# Altium schematic sheet 01-COVER PAGE.SchDoc
size 513 x 386 mm
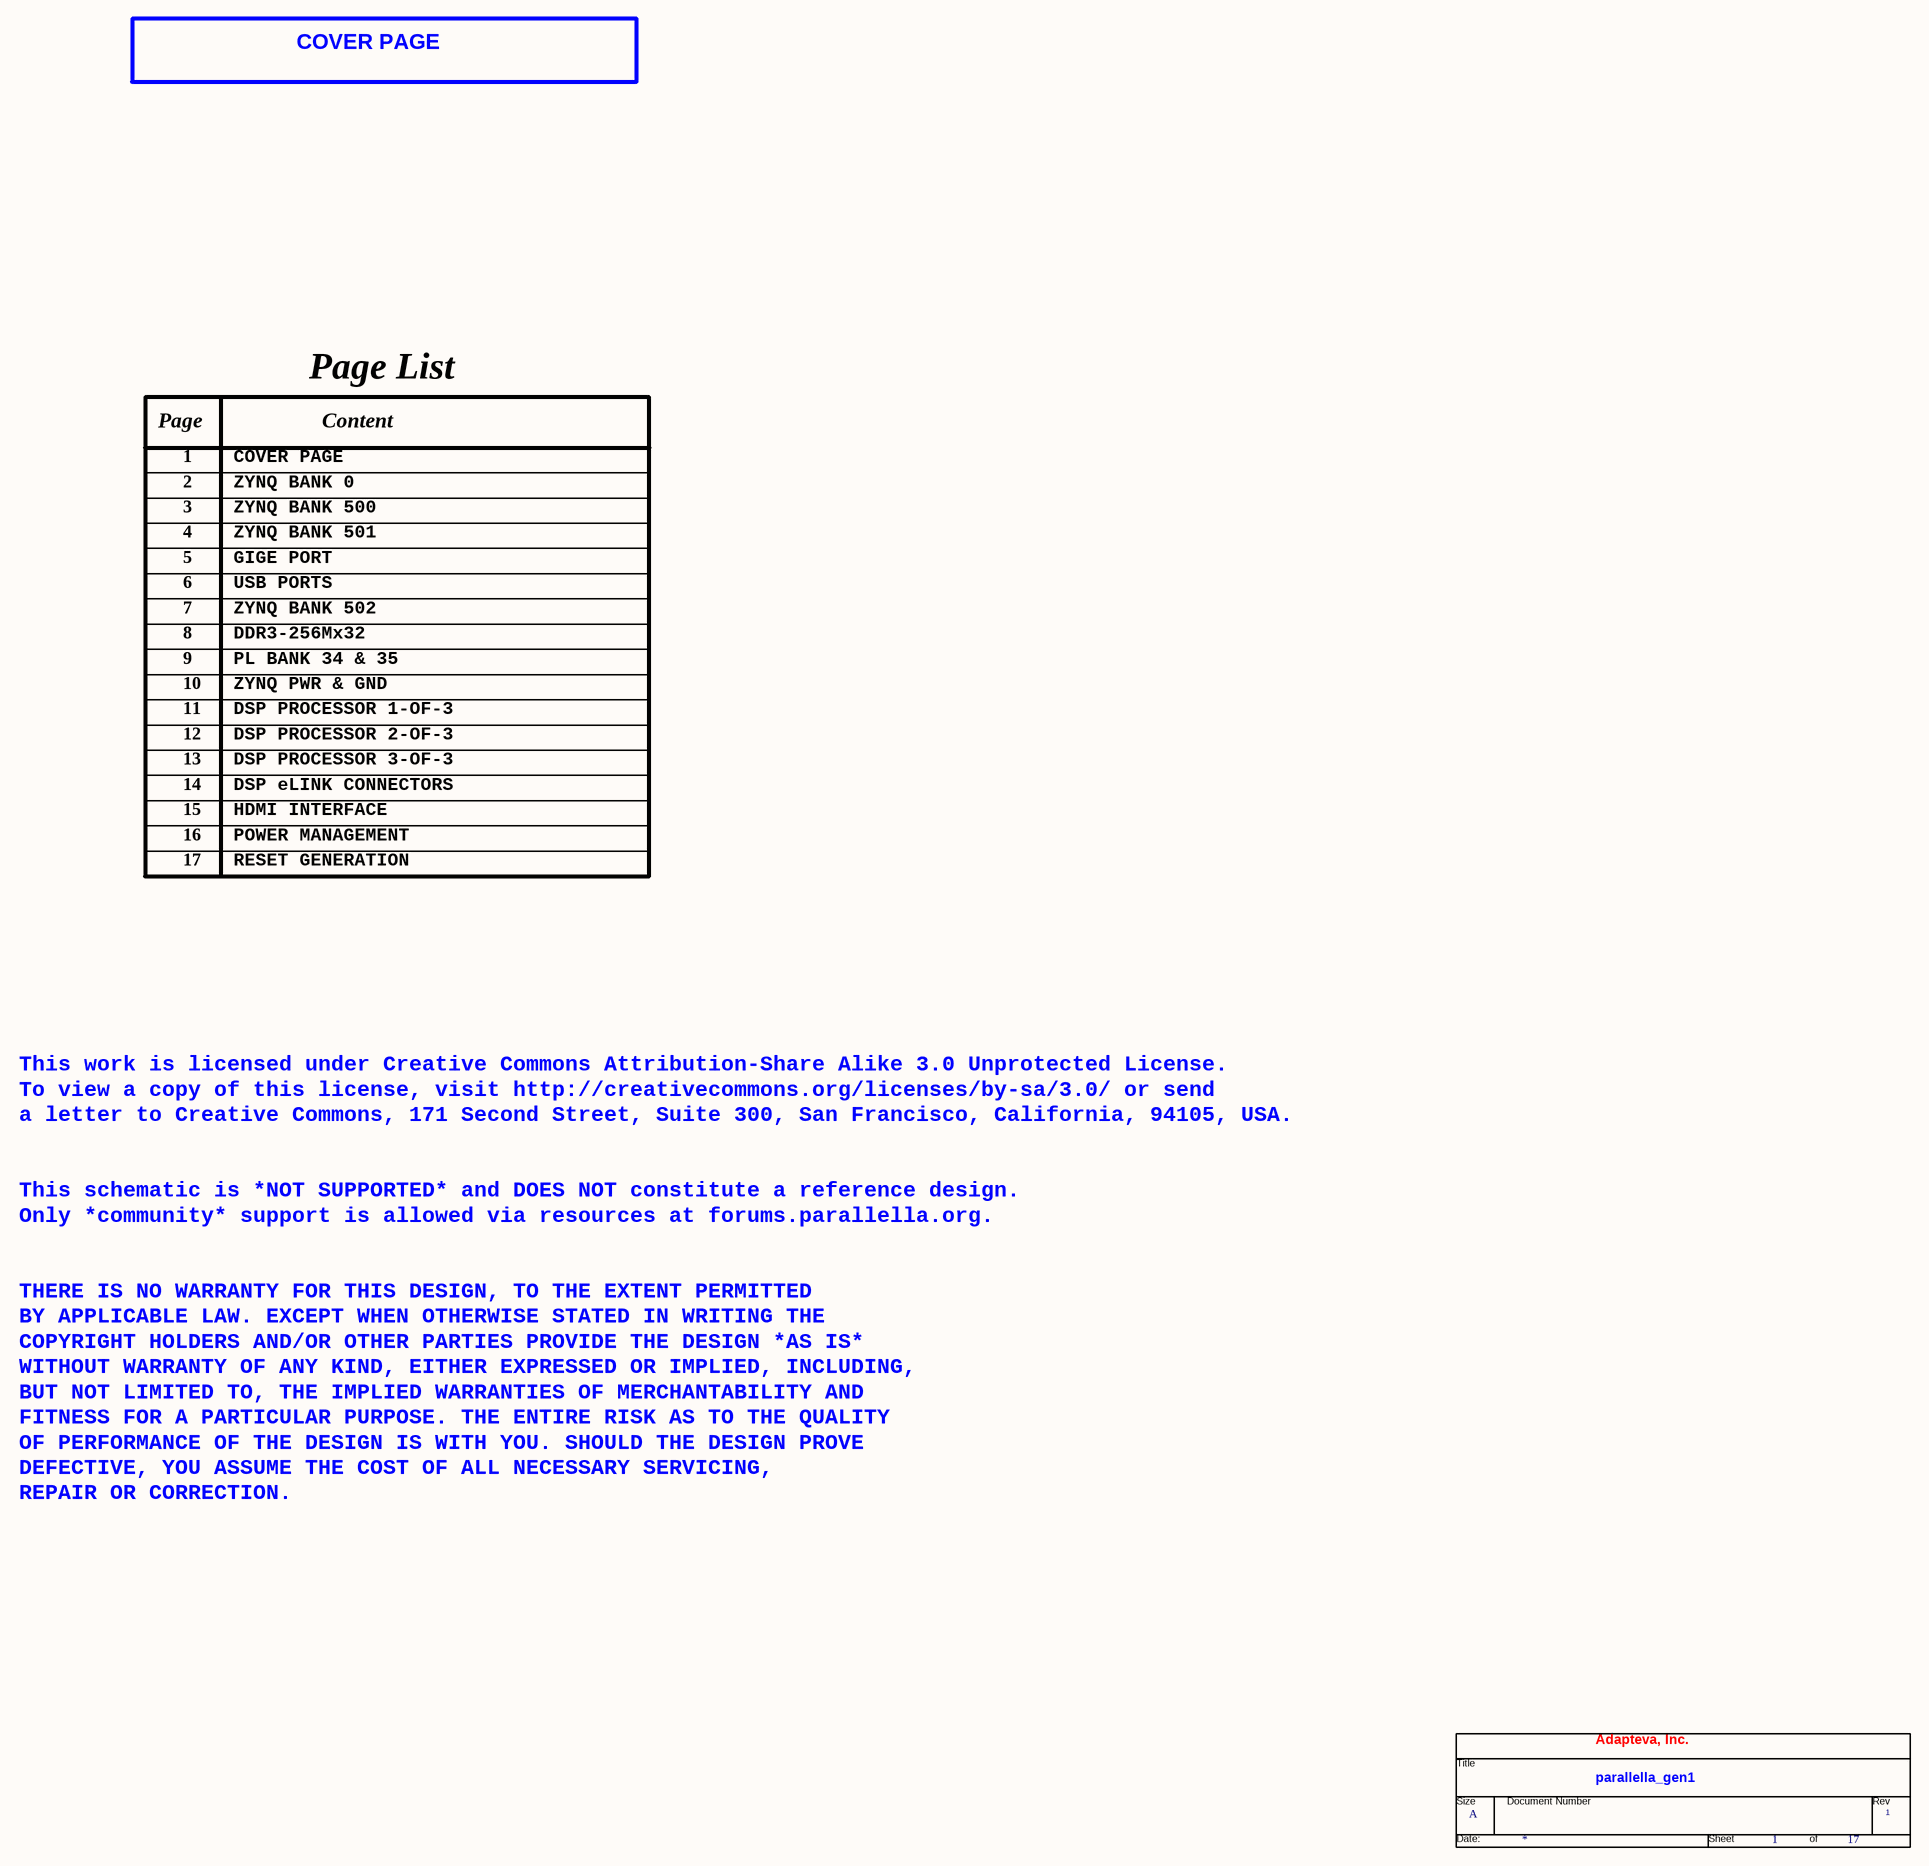
[diagram p0: 01-COVER PAGE.SchDoc]

## Parts
*  RevCode: 1  Title: parallella_gen1  Page Size: A  Page Count: 17  OrgAddr1: Adapteva, Inc.  (hidden comment: TitleBlock0)  (graphical)

## Notes on the sheet
- COVER PAGE
- Page List
- Page
- 1
- Content
- 3
- 2
- 4
- ZYNQ BANK 501
- ZYNQ BANK 0
- ZYNQ BANK 500
- 5
- 6
- GIGE PORT
- USB PORTS
- 7
- 8
- 9
- DDR3-256Mx32
- ZYNQ BANK 502
- PL BANK 34 & 35
- 10
- 11
- ZYNQ PWR & GND
- DSP PROCESSOR 1-OF-3
- 12
- 13
- 14
- DSP PROCESSOR 2-OF-3
- DSP PROCESSOR 3-OF-3
- DSP eLINK CONNECTORS
- 15
- 16
- HDMI INTERFACE
- POWER MANAGEMENT
- 17
- RESET GENERATION
- This work is licensed under Creative Commons Attribution-Share Alike 3.0 Unprotected License.
- To view a copy of this license, visit http://creativecommons.org/licenses/by-sa/3.0/ or send
- a letter to Creative Commons, 171 Second Street, Suite 300, San Francisco, California, 94105, USA.
- This schematic is *NOT SUPPORTED* and DOES NOT constitute a reference design.
- Only *community* support is allowed via resources at forums.parallella.org.
- THERE IS NO WARRANTY FOR THIS DESIGN, TO THE EXTENT PERMITTED
- BY APPLICABLE LAW. EXCEPT WHEN OTHERWISE STATED IN WRITING THE
- COPYRIGHT HOLDERS AND/OR OTHER PARTIES PROVIDE THE DESIGN *AS IS*
- WITHOUT WARRANTY OF ANY KIND, EITHER EXPRESSED OR IMPLIED, INCLUDING,
- BUT NOT LIMITED TO, THE IMPLIED WARRANTIES OF MERCHANTABILITY AND
- FITNESS FOR A PARTICULAR PURPOSE. THE ENTIRE RISK AS TO THE QUALITY
- OF PERFORMANCE OF THE DESIGN IS WITH YOU. SHOULD THE DESIGN PROVE
- DEFECTIVE, YOU ASSUME THE COST OF ALL NECESSARY SERVICING,
- REPAIR OR CORRECTION.
- (in symbol TitleBlock0) Title; Size; Document Number; Rev; Date:; Sheet; of

## Library data of the parts
* = TitleBlock0: Page Create Date: March  8, 1995; Page Number: 1; Page Modify Date: *